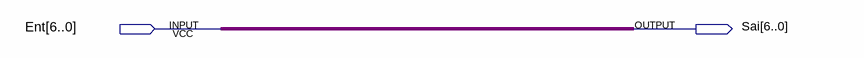
[diagram p0: schematic sheet]
// Quartus schematic teste.bdf as structural Verilog: 0 symbols, 2 pins
module teste (
  input  [6:0] Ent,
  output [6:0] Sai
);


  assign Sai = Ent;
endmodule
